# EAGLE design PDB_SR (EAGLE 7.6.0)
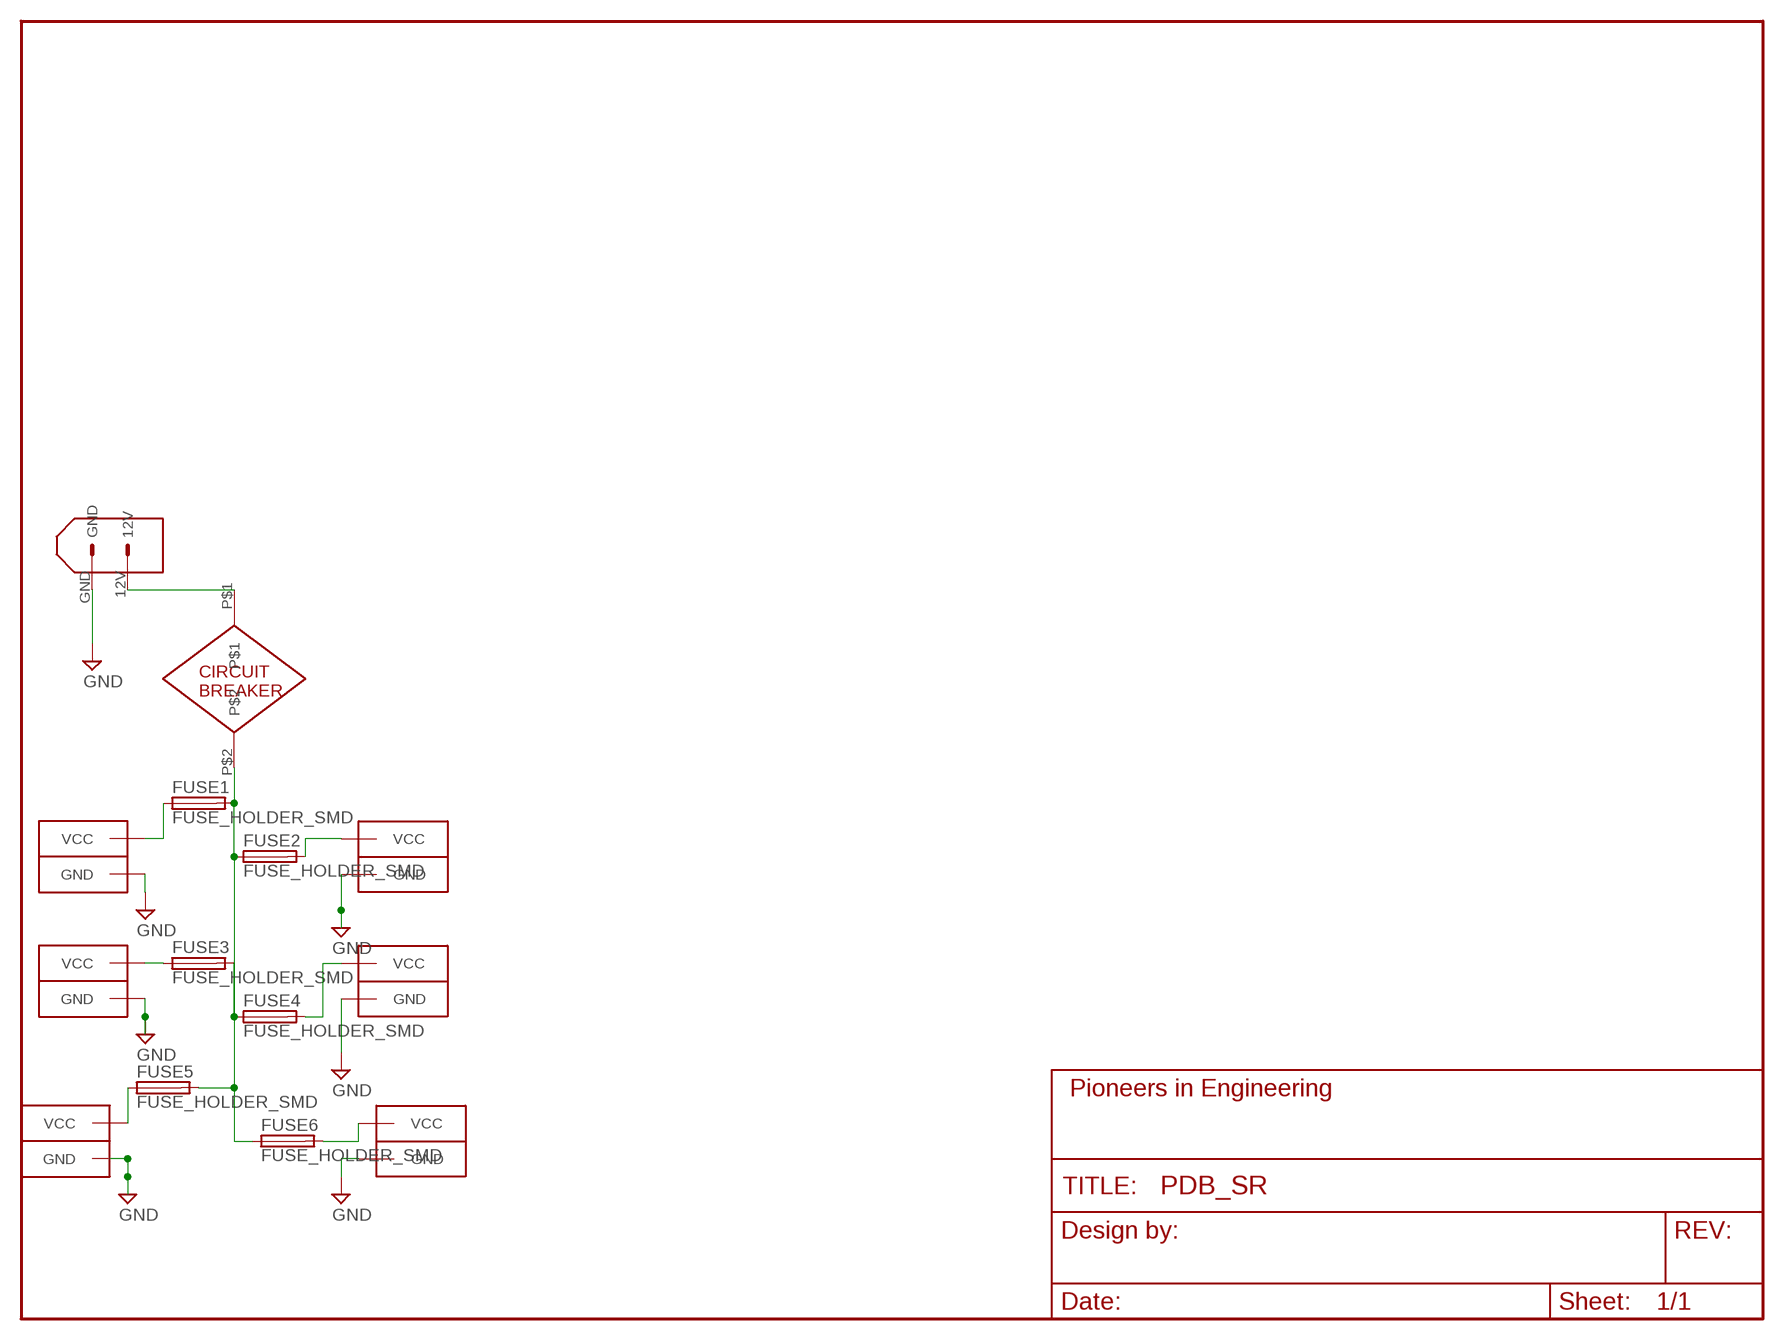
[diagram p0: schematic, sheet 1]

## Parts
CIRCUIT_BREAKER  CIRC_BREAKER  [CIRC_BREAKER]
CONN1  ANDERSONHORIZONTAL  [ANDERSON_HORIZONTAL]
CONN2  ANDERSONHORIZONTAL  [ANDERSON_HORIZONTAL]
CONN3  ANDERSONHORIZONTAL  [ANDERSON_HORIZONTAL]
CONN4  ANDERSONHORIZONTAL  [ANDERSON_HORIZONTAL]
CONN5  ANDERSONHORIZONTAL  [ANDERSON_HORIZONTAL]
CONN6  ANDERSONHORIZONTAL  [ANDERSON_HORIZONTAL]
FUSE1  FUSE_HOLDER_SMD  [FUSE_HOLDER_SMD]
FUSE2  FUSE_HOLDER_SMD  [FUSE_HOLDER_SMD]
FUSE3  FUSE_HOLDER_SMD  [FUSE_HOLDER_SMD]
FUSE4  FUSE_HOLDER_SMD  [FUSE_HOLDER_SMD]
FUSE5  FUSE_HOLDER_SMD  [FUSE_HOLDER_SMD]
FUSE6  FUSE_HOLDER_SMD  [FUSE_HOLDER_SMD]
U$1  XT60CONNECTOR  [XT60CONNECTOR]

## Nets
12V: CIRCUIT_BREAKER.P$2 FUSE1.P$2_DOWN FUSE1.P$2_UP FUSE2.P$1_DOWN FUSE2.P$1_UP FUSE3.P$2_DOWN FUSE3.P$2_UP FUSE4.P$1_DOWN FUSE4.P$1_UP FUSE5.P$2_DOWN FUSE5.P$2_UP FUSE6.P$1_DOWN FUSE6.P$1_UP
BAT: CIRCUIT_BREAKER.P$1 U$1.12V
GND: CONN1.PIN1(GND) CONN1.PIN1-LEAD(GND) CONN2.PIN1(GND) CONN2.PIN1-LEAD(GND) CONN3.PIN1(GND) CONN3.PIN1-LEAD(GND) CONN4.PIN1(GND) CONN4.PIN1-LEAD(GND) CONN5.PIN1(GND) CONN5.PIN1-LEAD(GND) CONN6.PIN1(GND) CONN6.PIN1-LEAD(GND) U$1.GND
VOUT1: CONN2.PIN2(VCC) CONN2.PIN2-LEAD(VCC) FUSE1.P$1_DOWN FUSE1.P$1_UP
VOUT2: CONN4.PIN2(VCC) CONN4.PIN2-LEAD(VCC) FUSE2.P$2_DOWN FUSE2.P$2_UP
VOUT3: CONN1.PIN2(VCC) CONN1.PIN2-LEAD(VCC) FUSE3.P$1_DOWN FUSE3.P$1_UP
VOUT4: CONN5.PIN2(VCC) CONN5.PIN2-LEAD(VCC) FUSE4.P$2_DOWN FUSE4.P$2_UP
VOUT5: CONN3.PIN2(VCC) CONN3.PIN2-LEAD(VCC) FUSE5.P$1_DOWN FUSE5.P$1_UP
VOUT6: CONN6.PIN2(VCC) CONN6.PIN2-LEAD(VCC) FUSE6.P$2_DOWN FUSE6.P$2_UP

## Library data of the parts
CIRCUIT_BREAKER = pie:CIRC_BREAKER: PiE Circuit Breaker: product page <http://www.waytekwire.com/item/46977/Bussmann-25550-B-2-Mid-Range-Circuit-Breaker-/>; MANUF: WAYTEK; MANUF-PN: 46977
CONN1-CONN6 = pie:ANDERSON: 2-pin 25A Anderson Connector http://www.alliedelec.com/images/products/datasheets/bm/ANDERSON_POWER_PRODUCTS/70162018.pdf; PIE-INT-REF-NUM: Anderson
FUSE1-FUSE6 = pie:FUSE_HOLDER_SMD: ATC/ATO Fuse Holder. Original variant datasheet <http://keyelco.com/userAssets/file/M65p43.pdf> and Digikey <http://www.digikey.com/product-detail/en/keystone-electronics/3587/36-3587-ND/2137315>; DIGIKEY-PN: 36-3587-ND; MANUF: KEYSTONE; MANUF-PN: 3587
U$1 = pie:XT60CONNECTOR: 12V XT60 power connector; PARTNUMBER: PRT-10474

## Board
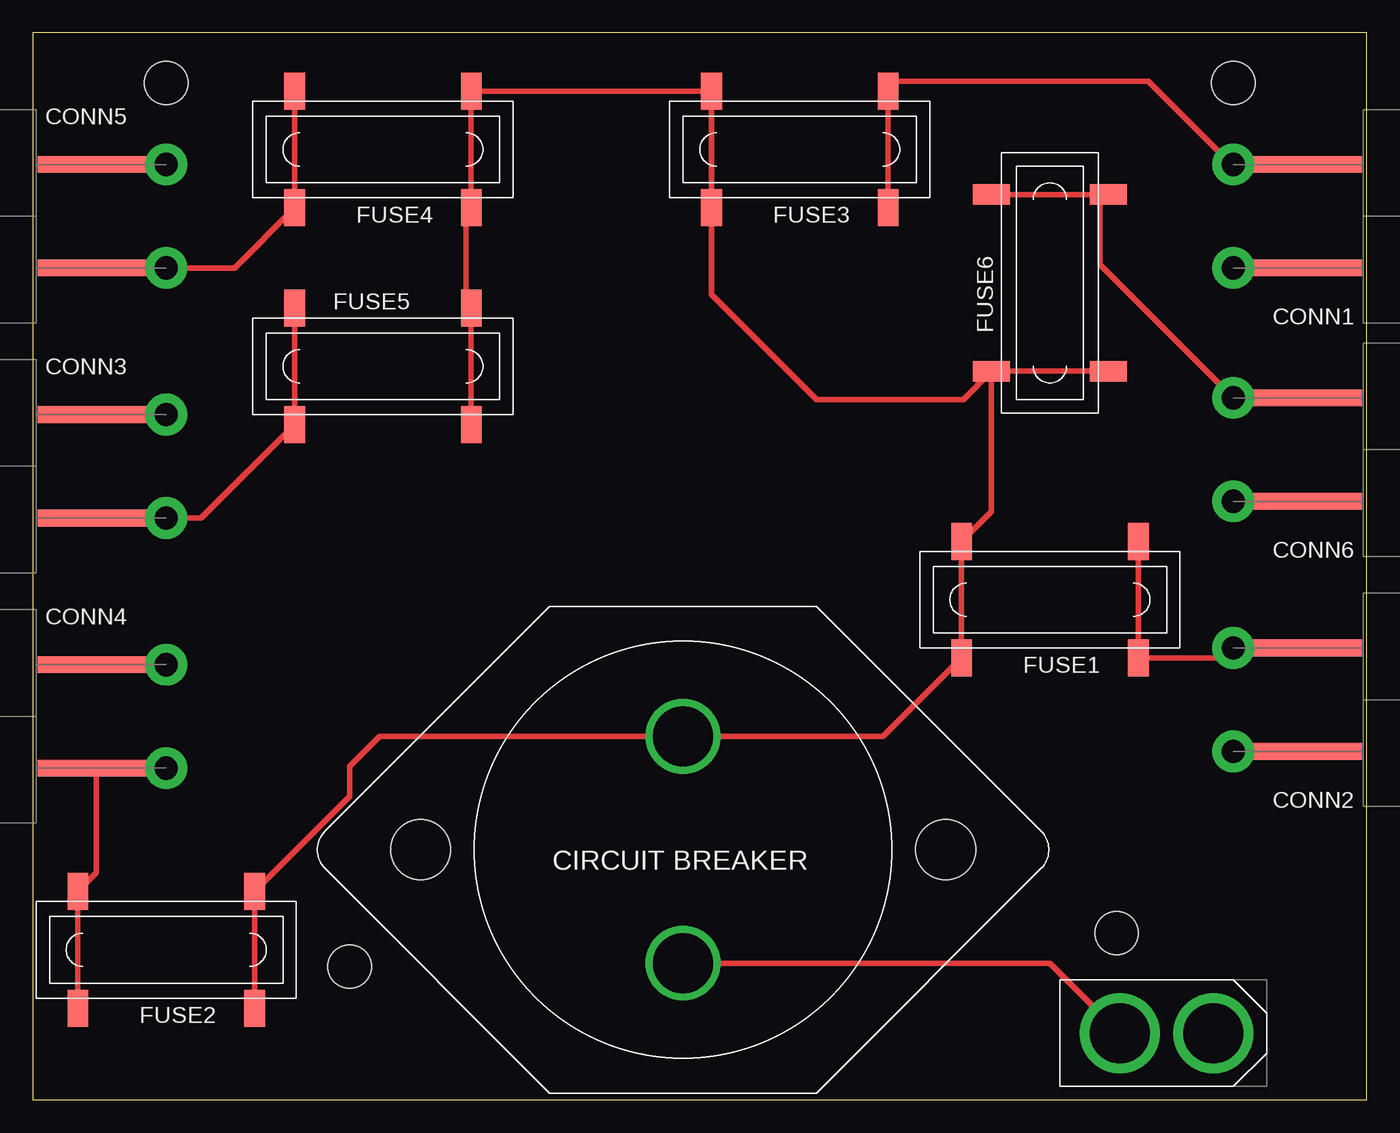
[diagram p1: board, top side]
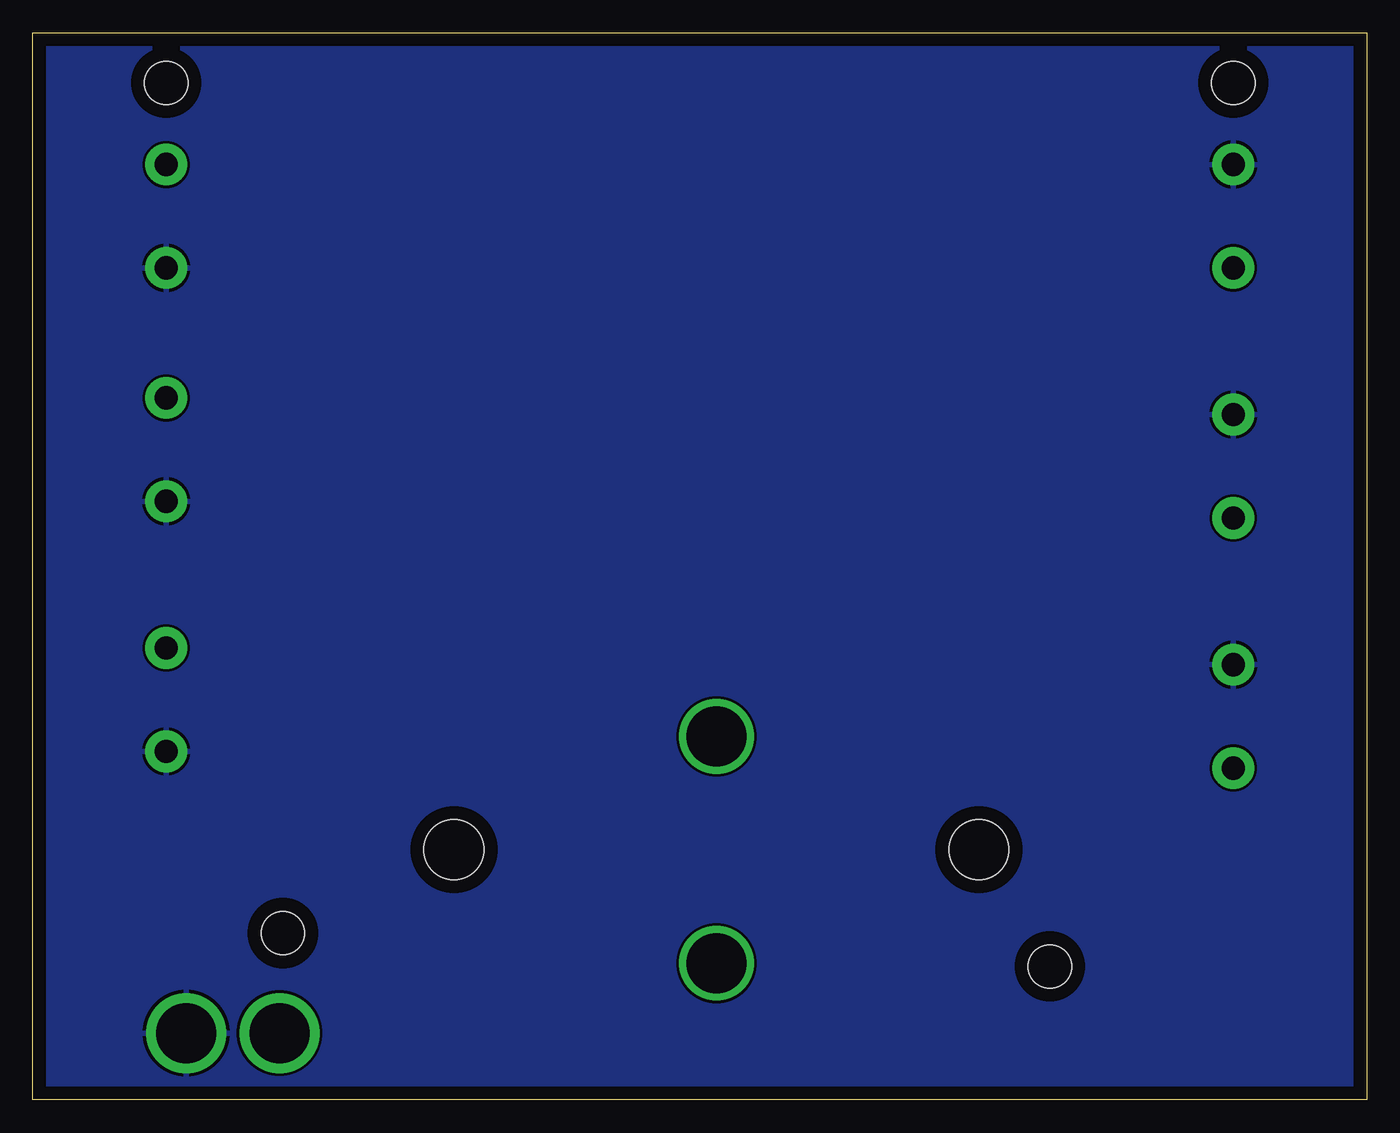
[diagram p2: board, bottom side, seen from below]

Size 101.6 x 81.28 mm. Coordinates in mm from the lower left corner, seen from the top.
Outline: 0,0 101.6,0 101.6,81.28 0,81.28 0,0
Copper layers (1*16): Top 0.035mm / dielectric 1.5mm / Bottom 0.035mm
Design rules "default": minimum track width 10mil, minimum drill 24mil, track to track 8mil, track to pad 8mil, pad to pad 8mil, via to via 8mil, smd to smd 8mil, copper to edge 40mil, drill to drill 8mil, minimum pad ring 10mil, minimum via ring 8mil, stop-mask expansion 4mil, vias tented up to drill 0mil, thermal gap 10mil

### Footprints (pad centres in the part's own frame; a part is rotated, then mirrored left to right if it is on the bottom)
CIRC_BREAKER = drill 4.572 pad 5.69: P$1 0,8.636; P$2 0,-8.636 | hole 4.572: -19.99,0; 19.99,0
ANDERSON_HORIZONTAL = drill 1.778 pad 3.175: PIN1 0,3.937; PIN2 0,-3.937 | smd 8.89 x 1.27: PIN1-LEAD -5.334,3.937; PIN2-LEAD -5.334,-3.937
FUSE_HOLDER_SMD = smd 1.575 x 2.819: P$1_DOWN -6.731,-4.445; P$1_UP -6.731,4.445; P$2_DOWN 6.731,-4.445; P$2_UP 6.731,4.445
XT60CONNECTOR = drill 4.572 pad 6.096: 12V -3.556,0; GND 3.556,0
STAND-OFF = hole 3.302: 0,0

### Placement (x,y rotation side)
CIRCUIT_BREAKER  49.53,19.05 180 top
CONN1  91.44,67.31 180 top
CONN2  91.44,30.48 180 top
CONN3  10.16,48.26 0 top
CONN4  10.16,29.21 0 top
CONN5  10.16,67.31 0 top
CONN6  91.44,49.53 180 top
FUSE1  77.47,38.1 180 top
FUSE2  10.16,11.43 180 top
FUSE3  58.42,72.39 180 top
FUSE4  26.67,72.39 180 top
FUSE5  26.67,55.88 0 top
FUSE6  77.47,62.23 90 top
U$1  86.36,5.08 0 top
U$2  [STAND-OFF]  24.13,10.16 0 top
U$3  [STAND-OFF]  10.16,77.47 0 top
U$4  [STAND-OFF]  91.44,77.47 0 top
U$5  [STAND-OFF]  82.55,12.7 0 top

### Tracks (layer width: path | path; a pad name or v marks a point on that pad's centre or on a via)
12V
  Top 0.406: 52.07,76.2 51.44,76.83 FUSE4.P$1_DOWN FUSE4.P$1_UP 33.4,67.69 33.02,67.31 33.02,59.69 | 52.07,76.2 52.07,76.45 FUSE3.P$2_DOWN | 52.07,76.2 51.69,75.82 FUSE3.P$2_UP 51.69,61.34 59.69,53.34 70.87,53.34 FUSE6.P$1_UP | FUSE2.P$1_UP FUSE2.P$1_DOWN 24.13,23.11 24.13,25.4 26.42,27.69 CIRCUIT_BREAKER.P$2 64.77,27.69 FUSE1.P$2_UP FUSE1.P$2_DOWN 73.03,44.83 FUSE6.P$1_UP | FUSE6.P$1_UP FUSE6.P$1_DOWN | FUSE5.P$2_DOWN 33.4,59.31 33.02,59.69 | FUSE5.P$2_UP 33.4,60.07 33.02,59.69
BAT
  Top 0.406: CIRCUIT_BREAKER.P$1 77.47,10.41 U$1.12V
GND
  Top 0.406: CONN4.PIN1 CONN4.PIN1-LEAD | CONN6.PIN1 CONN6.PIN1-LEAD | CONN2.PIN1 CONN2.PIN1-LEAD | CONN5.PIN1 CONN5.PIN1-LEAD | CONN3.PIN1 CONN3.PIN1-LEAD | CONN1.PIN1 CONN1.PIN1-LEAD
  pour Bottom: 0,81.28 101.6,81.28 101.6,0 0,0
VOUT1
  Top 0.406: CONN2.PIN2-LEAD CONN2.PIN2 90.68,33.66 FUSE1.P$1_UP FUSE1.P$1_DOWN
VOUT2
  Top 0.406: CONN4.PIN2 CONN4.PIN2-LEAD 4.83,17.27 FUSE2.P$2_DOWN FUSE2.P$2_UP
VOUT3
  Top 0.406: FUSE3.P$1_UP FUSE3.P$1_DOWN 65.91,77.6 84.96,77.6 91.44,71.12 CONN1.PIN2 CONN1.PIN2-LEAD
VOUT4
  Top 0.406: 20.32,76.45 FUSE4.P$2_DOWN | FUSE4.P$2_UP FUSE4.P$2_DOWN | FUSE4.P$2_DOWN 19.94,77.09 20.32,77.47 20.32,77.22 FUSE4.P$2_DOWN | 19.43,68.45 FUSE4.P$2_UP | FUSE4.P$2_UP 15.37,63.37 CONN5.PIN2 CONN5.PIN2-LEAD
VOUT5
  Top 0.406: CONN3.PIN2-LEAD CONN3.PIN2 12.83,44.32 FUSE5.P$1_DOWN FUSE5.P$1_UP
VOUT6
  Top 0.406: CONN6.PIN2-LEAD CONN6.PIN2 81.28,63.63 81.28,68.58 81.66,68.96 FUSE6.P$2_DOWN FUSE6.P$2_UP